# EAGLE design test_add_res_2_connected_2_valued_smashed (EAGLE 6.4)
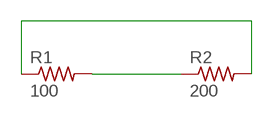
[diagram p0: schematic, sheet 1]

## Parts
R1  100  R-US_R0805  [R0805]
R2  200  R-US_R0805  [R0805]

## Nets
CONNECTION: R1.2 R2.1
N$1: R1.1 R2.2

## Library data of the parts
R1 R2 = rcl:R-US_: RESISTOR, American symbol

## Board
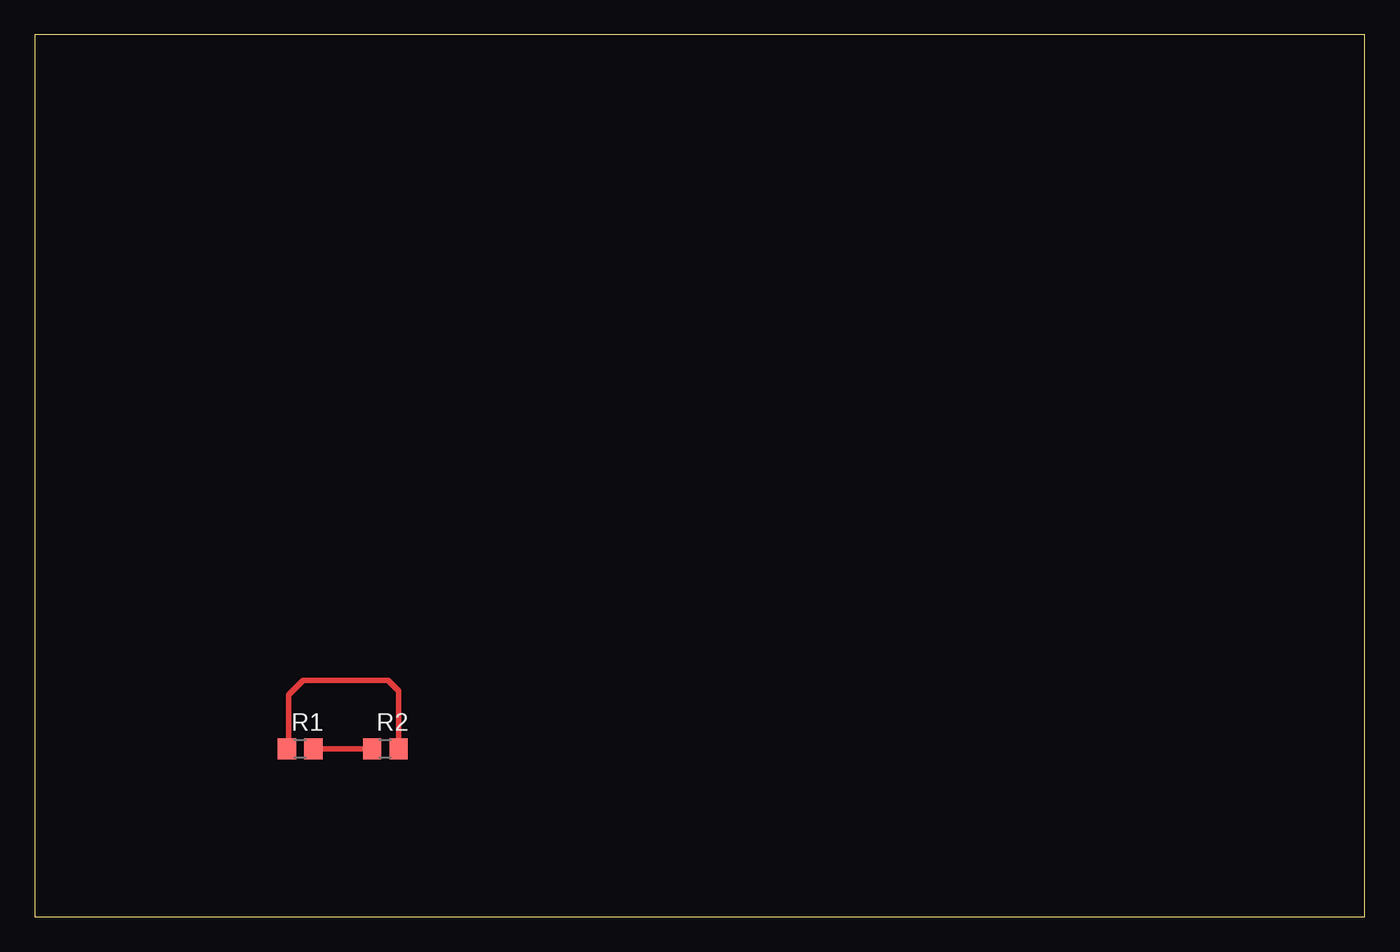
[diagram p1: board, top side]

Size 95.23 x 63.17 mm. Coordinates in mm from the lower left corner, seen from the top.
Outline: 0,0 95.23,0 95.23,63.17 0,63.17 0,0
Copper layers (1*2*3*16): Top 0.035mm / dielectric 1.5mm / Route2 0.035mm / dielectric 0.15mm / Route3 0.035mm / dielectric 0.2mm / Bottom 0.035mm
Design rules "default *": minimum track width 10mil, minimum drill 24mil, track to track 8mil, track to pad 8mil, pad to pad 8mil, via to via 8mil, smd to smd 8mil, copper to edge 40mil, drill to drill 8mil, minimum pad ring 10mil, minimum via ring 8mil, stop-mask expansion 4mil, vias tented up to drill 0mil, thermal gap 10mil

### Footprints (pad centres in the part's own frame; a part is rotated, then mirrored left to right if it is on the bottom)
R0805 = smd 1.3 x 1.5: 1 -0.95,0; 2 0.95,0

### Placement (x,y rotation side)
R1  19,12.04 0 top
R2  25.1,12.04 0 top

### Tracks (layer width: path | path; a pad name or v marks a point on that pad's centre or on a via)
CONNECTION
  Top 0.406: R1.2 R2.1
N$1
  Top 0.406: R2.2 26.05,16.17 25.3,16.92 19.2,16.92 18.19,15.9 18.19,12.18 R1.1